# EasyEDA Pro project ProPrj_FOC_STM32F446.epro, board PCB1
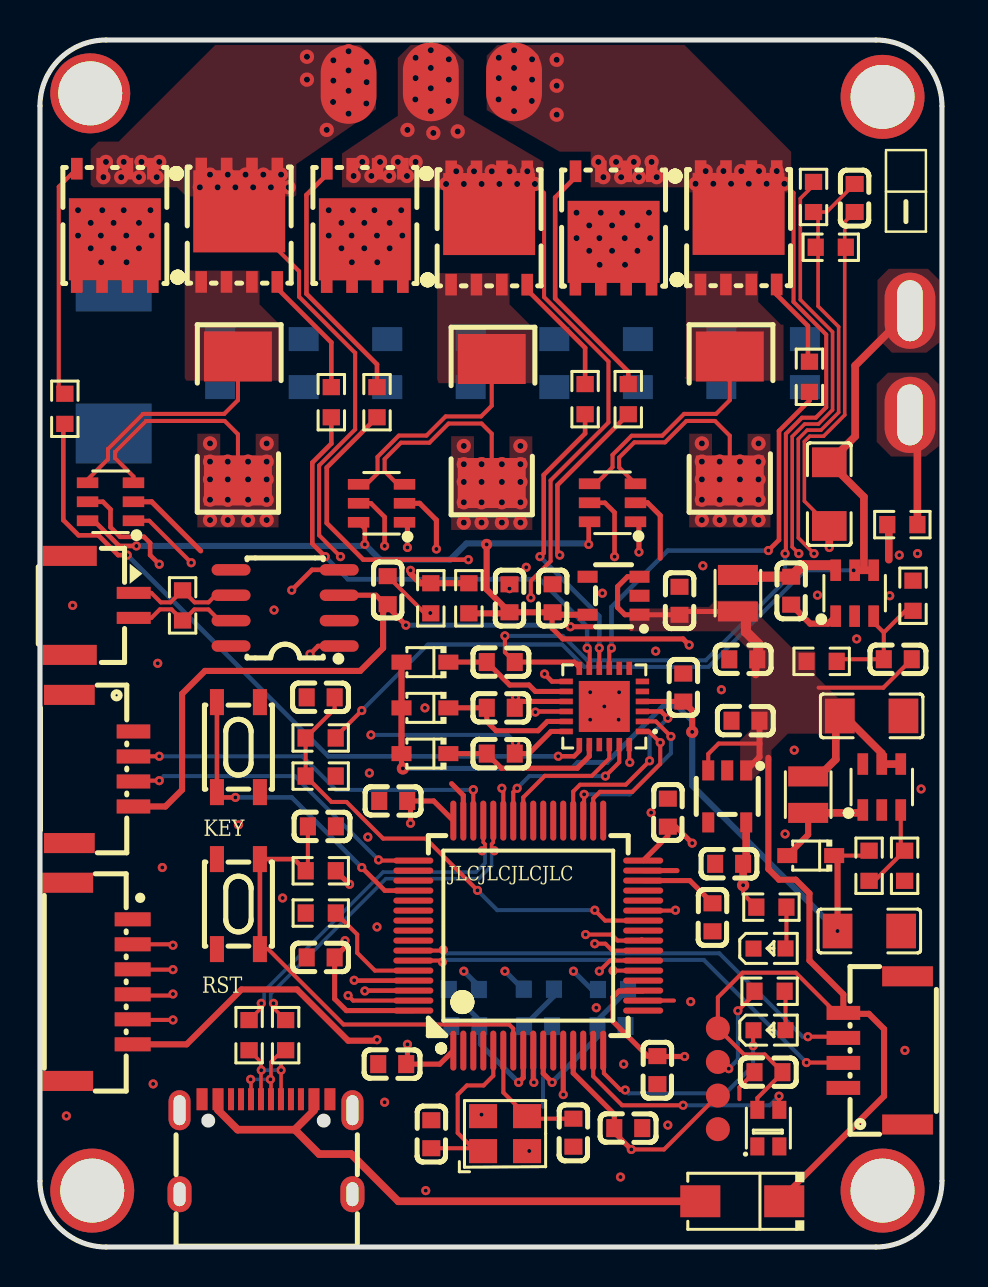
[diagram p3: board, top side]
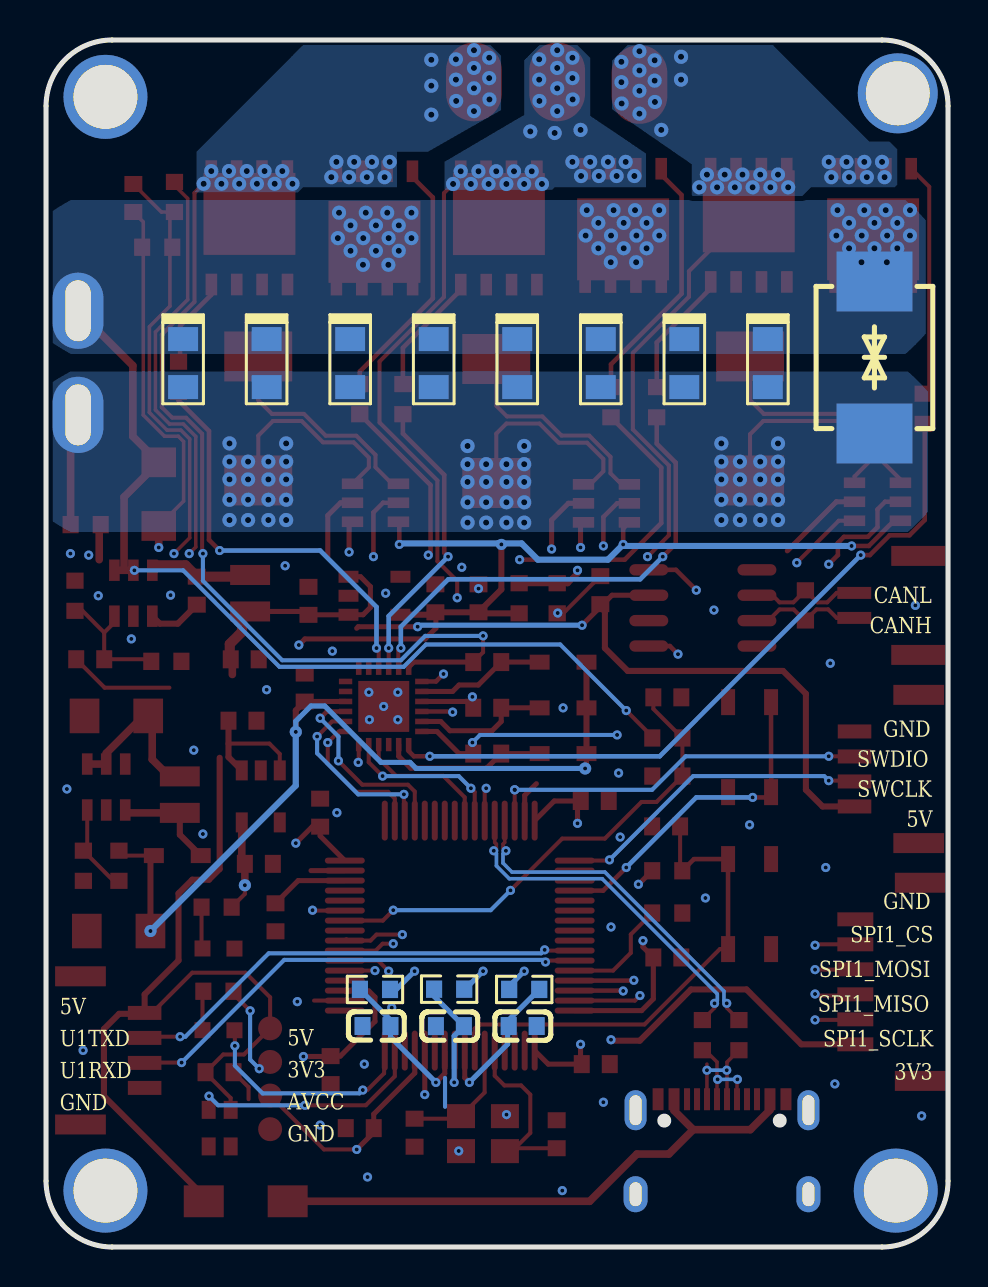
[diagram p4: board, bottom side, seen from below]

Outline 45.14 x 60.35 mm; copper layers: Top Layer, Inner1, Inner2, Bottom Layer. Coordinates in mm from the lower left corner of the outline.
Outline path: 0,57.05 0,3.3 arc(0.97,0.97) 3.3,0 41.83,0 arc(44.17,0.97) 45.14,3.3 45.14,57.05 arc(44.17,59.38) 41.83,60.35 3.3,60.35 arc(0.97,59.38) 0,57.05
Stack: Top Layer 0.035mm 外层铜厚1oz / Dielectric1 0.2104mm 7628 RC49% 8.6mil / Inner1 0.0152mm 内层铜厚 / Dielectric2 1.065mm 1.1mm H/HOZ 含铜 / Inner2 0.0152mm 内层铜厚 / Dielectric3 0.2104mm 7628 RC49% 8.6mil / Bottom Layer 0.035mm 外层铜厚1oz

## Design rules (mm)
net USB_DP: DP1
net USB_DN: DP1
template: 自定义配置
spacing copperThickness1oz (default): track to track 0.127, other pairs 0.102 to 0.152
spacing copperThickness2oz: track to track 0.203, other pairs 0.152 to 0.3
track width copperThickness1oz (default): min 0.127, default 0.254, max 2.54
track width copperThickness2oz: min 0.203, default 0.254, max 2.54
differential pair differentialPair (default): width min 0.127, default 0.254, max 2.54; gap min 0.152, default 0.152
via viaSize (default): diameter min 0.457, default 0.61, max 10; hole min 0.203, default 0.203, max 6.299
net DCBUS uses copperRegion1
net PGND uses copperRegion1, innerPlane1

## Placement (name value [footprint] x y rotation side)
C1  1UF  [C0603]  35.31 26.31 0 top
C2  1UF  [C0603]  34.49 19.16 0 top
C3  22uF  [C1206]  41.5 15.8 180 top
C4  22uF  [C1206]  41.62 26.56 0 top
C5  100nF  [C0603]  37.59 32.82 90 top
C6  1UF  [C0603]  32 32.31 270 top
C7  1UF  [C0603]  25.65 32.44 270 top
C8  100nF  [C0603]  23.5 32.44 270 top
C9  10uF  [C1206]  39.5 37.64 90 top
C10  10UF  [C0603]  35.19 29.38 0 top
C11  470PF  [C0603]  42.93 29.39 180 top
C12  22uF  [CAP-SMD_L3.2-W1.6-FD]  13.2 44.2 270 bottom
C13  22uF  [CAP-SMD_L3.2-W1.6-FD]  21.56 44.2 270 bottom
C14  22uF  [CAP-SMD_L3.2-W1.6-FD]  25.74 44.2 270 bottom
C15  22uF  [CAP-SMD_L3.2-W1.6-FD]  34.1 44.2 270 bottom
C16  22uF  [CAP-SMD_L3.2-W1.6-FD]  17.38 44.2 270 bottom
C17  22uF  [CAP-SMD_L3.2-W1.6-FD]  29.92 44.2 270 bottom
C18  22uF  [CAP-SMD_L3.2-W1.6-FD]  9.02 44.2 270 bottom
C19  1UF  [C0603]  14.05 27.48 0 top
C20  100nF  [C0603]  36.45 8.74 0 top
C21  1nF  [C0603]  21.29 11.05 0 bottom
C22  1nF  [C0603]  24.93 11.04 180 bottom
C23  1nF  [C0603]  28.6 11.05 180 bottom
C24  100nF  [C0603]  29.44 5.94 0 top
C25  100nF  [C0603]  14.11 21.03 180 top
C26  2.2UF  [C0603]  33.66 16.48 90 top
C27  100nF  [C0603]  17.68 22.3 0 top
C28  100nF  [C0603]  31.42 21.72 270 top
C29  100nF  [C0603]  30.9 8.84 90 top
C30  100nF  [C0603]  17.63 9.14 0 top
C31  100nF  [C0603]  14.05 14.48 0 top
C32  100nF  [C0603]  17.4 32.84 270 top
C33  12PF  [C0603]  26.7 5.72 90 top
C34  12PF  [C0603]  19.58 5.64 270 top
C35  1UF  [C0603]  23.06 24.67 180 top
C36  1UF  [C0603]  23.06 26.96 180 top
C37  10UF  [C0603]  32.19 27.97 270 top
C39  1UF  [C0603]  23.06 29.25 180 top
C40  2.2UF  [C0603]  40.77 52.45 90 top
C41  22uF  [CAP-SMD_L3.2-W1.6-FD]  38.28 44.2 270 bottom
CN1  L125WVS-02PW  [CONN-SMD_2P-P1.25_DELON_L125WVS-02PW]  3.09 32.08 270 top
D1  1N5819WS  [SOD-323_L1.8-W1.3-LS2.5-RD]  38.57 19.57 180 top
D2  SMCJ36CA  [SMC_L7.2-W5.8-LS8.1-BI]  3.68 44.48 90 bottom
D3  SS34  [SMA_L4.3-W2.5-LS5.0-RD]  35.14 2.29 180 top
D4  1N5819WS  [SOD-323_L1.8-W1.3-LS2.5-RD]  19.26 24.67 180 top
D5  1N5819WS  [SOD-323_L1.8-W1.3-LS2.5-RD]  19.26 26.96 180 top
D6  1N5819WS  [SOD-323_L1.8-W1.3-LS2.5-RD]  19.26 29.24 180 top
J1  GH1.25  [conn-smd_4p-p1.25_js_gh125-s04cca-00]  41.94 9.83 90 top
J2  GH1.25  [conn-smd_4p-p1.25_js_gh125-s04cca-00]  2.95 23.9 270 top
L1  10uH  [IND-SMD_L2.5-W2.0_FNR252012S]  38.44 22.62 270 top
L2  4.7uH  [IND-SMD_L2.5-W2.0_FNR252012S]  34.92 32.69 90 top
LED1  -  [LED_0603]  36.56 14.93 0 top
LED2  WS2812B-2020  [LED-SMD_4P-L2.0-W2.0-TL_WS2812B-2020]  36.45 5.94 90 top
LED3  -  [LED_0603]  36.56 10.85 0 top
NOREF  -  [Pad_e450]  15.44 58.13 180 top
NOREF#2  -  [Pad_e458]  42.16 2.82 180 top
NOREF#3  -  [Pad_e454]  42.16 57.51 180 top
NOREF#4  -  [Pad_e685]  23.72 58.26 180 top
NOREF#5  -  [Pad_e457]  2.62 2.82 180 top
NOREF#6  -  [Pad_e270]  43.54 46.81 0 top
NOREF#7  -  [Pad_e663]  19.56 58.26 180 top
NOREF#8  -  [Pad_e267]  43.54 41.61 0 top
NOREF#9  -  [Pad_e456]  2.52 57.68 180 top
Q1  KNY3406C  [PDFN-8_L4.9-W5.8-P1.27-LS6.1-BL]  3.75 51.08 180 top
Q2  KNY3406C  [PDFN-8_L4.9-W5.8-P1.27-LS6.1-BL]  16.26 51.08 180 top
Q3  KNY3406C  [PDFN-8_L4.9-W5.8-P1.27-LS6.1-BL]  28.7 50.95 180 top
Q4  KNY3406C  [PDFN-8_L4.9-W5.8-P1.27-LS6.1-BL]  9.97 51.09 0 top
Q5  KNY3406C  [PDFN-8_L4.9-W5.8-P1.27-LS6.1-BL]  22.48 50.95 0 top
Q6  KNY3406C  [PDFN-8_L4.9-W5.8-P1.27-LS6.1-BL]  34.96 50.96 0 top
R1  100kΩ  [R0603]  41.49 19.06 90 top
R2  10K  [R0603]  36.6 16.99 0 top
R3  5.1kΩ  [R0603]  43.27 19.06 90 top
R4  52.3K  [R0603]  39.12 29.28 0 top
R5  10K  [R0603]  43.69 32.56 270 top
R6  0R  [R0603]  43.15 36.12 0 top
R7  10K  [R0603]  14.05 25.45 0 top
R8  1K  [R0603]  14.05 23.55 180 top
R9  10K  [R0603]  14.05 16.7 180 top
R10  22R  [R0603]  12.29 10.59 270 top
R11  22R  [R0603]  10.47 10.59 270 top
R12  22  [R0603]  21.21 12.88 180 bottom
R13  22  [R0603]  24.97 12.89 0 bottom
R14  22  [R0603]  28.68 12.88 0 bottom
R15  10K  [R0603]  14.05 18.81 0 top
R16  120R  [R0603]  7.14 32.08 270 top
R17  10K  [R0603]  36.51 12.79 180 top
R18  1K  [R0603]  21.46 32.44 270 top
R19  1K  [R0603]  19.56 32.44 90 top
R20  10R  [R0603]  1.24 41.91 90 top
R21  10R  [R0603]  16.87 42.24 90 top
R22  10R  [R0603]  29.44 42.39 90 top
R23  TCTR0603F10K0F3930T  [R0603]  38.71 52.5 90 top
R24  10R  [R0603]  14.58 42.24 90 top
R25  10R  [R0603]  27.28 42.39 90 top
R26  3.3K  [R0603]  39.57 49.99 180 top
R27  10R  [R0603]  38.51 43.51 90 top
R28  5mΩ  [RES-SMD_L6.4-W3.2-1]  9.91 41.43 90 top
R29  5mΩ  [RES-SMD_L6.4-W3.2-1]  22.61 41.3 90 top
R30  5mΩ  [RES-SMD_L6.4-W3.2-1]  34.52 41.43 90 top
SW1  TS-1089S-02526  [SW-SMD_4P-L4.2-W3.3-P2.15-LS5.1]  9.93 17.15 270 top
SW2  TS-1089S-02526  [SW-SMD_4P-L4.2-W3.3-P2.15-LS5.1]  9.93 24.99 90 top
TP1  Testpoint 1.6mm  [TESTPOINT 1.6MM]  33.92 10.93 0 top
TP2  Testpoint 1.6mm  [TESTPOINT 1.6MM]  33.92 9.25 0 top
TP3  Testpoint 1.6mm  [TESTPOINT 1.6MM]  33.92 7.57 0 top
TP4  Testpoint 1.6mm  [TESTPOINT 1.6MM]  33.92 5.89 0 top
U1  LP5907MFX-3.3/NOPB  [SOT-23-5_L3.0-W1.7-P0.95-LS2.8-BR]  34.39 22.53 90 top
U2  MT3608  [SOT-23-6_L2.9-W1.6-P0.95-LS2.8-BL]  42.13 23 0 top
U3  LP5907MFX-3.3/NOPB  [SOT-23-5_L3.0-W1.7-P0.95-LS2.8-BR]  28.7 32.56 0 top
U4  RY8411  [SOT-23-6_L2.9-W1.6-P0.95-LS2.8-TL]  40.77 32.69 90 top
U5  STM32F446RET6  [LQFP-64_L10.0-W10.0-P0.50-LS12.0-BL]  24.44 15.57 0 top
U6  TJA1050T/CM,118  [SOIC-8_L5.0-W4.0-P1.27-LS6.0-BL]  12.27 31.95 90 top
U7  INA181A2IDBVR  [SOT-23-6_L2.9-W1.6-P0.95-LS2.8-BL]  3.53 37.26 90 top
U8  FD6288Q  [QFN-24_L4.0-W4.0-P0.50-BL-EP2.6]  28.24 27.03 90 top
U9  INA181A2IDBVR  [SOT-23-6_L2.9-W1.6-P0.95-LS2.8-BL]  17.09 37.19 90 top
U10  INA181A2IDBVR  [SOT-23-6_L2.9-W1.6-P0.95-LS2.8-BL]  28.65 37.21 90 top
USB1  TYPE-C 16PIN 2MD(073)  [USB-C-SMD_TYPE-C-6PIN-2MD-073]  11.31 5.01 0 top
X1  GH125-S06DCA-00  [conn-smd_6p-p1.25_jushuo_gh125-s06dca-00]  2.89 13.26 270 top
X2  8MHz  [OSC-SMD_4P-L3.2-W2.5-BL]  23.27 5.67 0 top

## Footprints (pads in the part's own frame, mm; a bottom-side part is the same pattern mirrored in y, then rotated)
C0603
  rect 0.8x0.9 smd: 1(-0.7,0) 2(0.7,0)
C1206
  rect 1.485x1.728 smd: 1(-1.593,0) 2(1.593,0)
CAP-SMD_L3.2-W1.6-FD
  rect 1.2x1.5 smd: 1(-1.2,0) 2(1.2,0)
CONN-SMD_2P-P1.25_DELON_L125WVS-02PW
  rect 0.6x1.7 smd: 1(-0.625,1.6) 2(0.625,1.6)
  rect 1x2.7 smd: 3(2.475,-1.6) 4(-2.475,-1.6)
conn-smd_4p-p1.25_js_gh125-s04cca-00
  rect 0.7x1.68 smd: 1(-1.875,1.732) 2(-0.625,1.732) 3(0.625,1.732) 4(1.875,1.732)
  rect 1x2.54 smd: 5(3.705,-1.478) 6(-3.705,-1.478)
conn-smd_6p-p1.25_jushuo_gh125-s06dca-00
  rect 0.7x1.8 smd: 1(-3.125,1.75) 2(-1.875,1.75) 3(-0.625,1.75) 4(0.625,1.75) 5(1.875,1.75) 6(3.125,1.75)
  rect 1x2.54 smd: 7(4.955,-1.497) 8(-4.955,-1.497)
IND-SMD_L2.5-W2.0_FNR252012S
  rect 1.001x1.999 smd: 1(0.912,0) 2(-0.912,0)
LED-SMD_4P-L2.0-W2.0-TL_WS2812B-2020
  rect 0.9x0.7 smd: 1(-0.915,0.55) 2(-0.915,-0.55) 3(0.915,-0.55) 4(0.915,0.55)
LED_0603
  rect 0.8x0.8 smd: 1(-0.851,-0.01) 2(0.75,-0.005)
LQFP-64_L10.0-W10.0-P0.50-LS12.0-BL
  oval 0.3x2 smd: 1(-3.75,-5.75) 2(-3.25,-5.75) 3(-2.75,-5.75) 4(-2.25,-5.75) 5(-1.75,-5.75) 6(-1.25,-5.75) 7(-0.75,-5.75) 8(-0.25,-5.75) 9(0.25,-5.75) 10(0.75,-5.75) 11(1.25,-5.75) 12(1.75,-5.75) 13(2.25,-5.75) 14(2.75,-5.75) 15(3.25,-5.75) 16(3.75,-5.75) 33(3.75,5.75) 34(3.25,5.75) 35(2.75,5.75) 36(2.25,5.75) 37(1.75,5.75) 38(1.25,5.75) 39(0.75,5.75) 40(0.25,5.75) 41(-0.25,5.75) 42(-0.75,5.75) 43(-1.25,5.75) 44(-1.75,5.75) 45(-2.25,5.75) 46(-2.75,5.75) 47(-3.25,5.75) 48(-3.75,5.75)
  oval 2x0.3 smd: 17(5.75,-3.75) 18(5.75,-3.25) 19(5.75,-2.75) 20(5.75,-2.25) 21(5.75,-1.75) 22(5.75,-1.25) 23(5.75,-0.75) 24(5.75,-0.25) 25(5.75,0.25) 26(5.75,0.75) 27(5.75,1.25) 28(5.75,1.75) 29(5.75,2.25) 30(5.75,2.75) 31(5.75,3.25) 32(5.75,3.75) 49(-5.75,3.75) 50(-5.75,3.25) 51(-5.75,2.75) 52(-5.75,2.25) 53(-5.75,1.75) 54(-5.75,1.25) 55(-5.75,0.75) 56(-5.75,0.25) 57(-5.75,-0.25) 58(-5.75,-0.75) 59(-5.75,-1.25) 60(-5.75,-1.75) 61(-5.75,-2.25) 62(-5.75,-2.75) 63(-5.75,-3.25) 64(-5.75,-3.75)
OSC-SMD_4P-L3.2-W2.5-BL
  rect 1.4x1.2 smd: 1(-1.1,-0.875) 2(1.1,-0.875) 3(1.1,0.875) 4(-1.1,0.875)
Pad_e267
  oval 2.54x3.81 hole 1.27x3.048: 66(0,0)
Pad_e270
  oval 2.54x3.81 hole 1.27x3.048: 66(0,0)
Pad_e450
  oval 2.794x3.937 smd: 1(0,0)
Pad_e454
  round 4.2 hole 3.2: 1(0,0)
Pad_e456
  round 4 hole 3.2: 1(0,0)
Pad_e457
  round 4.2 hole 3.2: 1(0,0)
Pad_e458
  round 4.2 hole 3.2: 1(0,0)
Pad_e663
  oval 2.794x3.937 smd: 1(0,0)
Pad_e685
  oval 2.794x3.937 smd: 1(0,0)
PDFN-8_L4.9-W5.8-P1.27-LS6.1-BL
  rect 0.58x1.079 smd: 1(-1.907,-2.834) 2(-0.637,-2.834) 3(0.632,-2.834) 4(1.903,-2.834)
  rect 0.58x1.08 smd: 5(1.907,2.834) 6(0.637,2.834) 7(-0.632,2.834) 8(-1.903,2.834)
  rect 4.6x4.1 smd: 9(-0.003,0.695)
QFN-24_L4.0-W4.0-P0.50-BL-EP2.6
  rect 0.28x0.665 smd: 1(-1.25,-1.907) 2(-0.75,-1.907) 3(-0.25,-1.907) 4(0.25,-1.907) 5(0.75,-1.907) 6(1.25,-1.907) 13(1.25,1.907) 14(0.75,1.907) 15(0.25,1.907) 16(-0.25,1.907) 17(-0.75,1.907) 18(-1.25,1.907)
  rect 0.665x0.28 smd: 7(1.907,-1.25) 8(1.907,-0.75) 9(1.907,-0.25) 10(1.907,0.25) 11(1.907,0.75) 12(1.907,1.25) 19(-1.907,1.25) 20(-1.907,0.75) 21(-1.907,0.25) 22(-1.907,-0.25) 23(-1.907,-0.75) 24(-1.907,-1.25)
  rect 2.55x2.55 smd: 25(0,0)
R0603
  rect 0.806x0.864 smd: 1(-0.753,0) 2(0.753,0)
RES-SMD_L6.4-W3.2-1
  rect 2.5x3.4 smd: 1(-3.1,0) 2(3.1,0)
SMA_L4.3-W2.5-LS5.0-RD
  rect 2x1.593 smd: 1(-2.1,0) 2(2.1,0)
SMC_L7.2-W5.8-LS8.1-BI
  rect 3x3.8 smd: 1(-3.8,0) 2(3.8,0)
SOD-323_L1.8-W1.3-LS2.5-RD
  rect 1x0.75 smd: 1(-1.173,0) 2(1.173,0)
SOIC-8_L5.0-W4.0-P1.27-LS6.0-BL
  oval 0.569x1.95 smd: 1(-1.905,-2.705) 2(-0.635,-2.705) 3(0.635,-2.705) 4(1.905,-2.705) 5(1.905,2.705) 6(0.635,2.705) 7(-0.635,2.705) 8(-1.905,2.705)
SOT-23-5_L3.0-W1.7-P0.95-LS2.8-BR
  rect 1x0.6 smd: 1(1.3,-0.95) 2(1.3,0) 3(1.3,0.95) 4(-1.3,0.95) 5(-1.3,-0.95)
SOT-23-6_L2.9-W1.6-P0.95-LS2.8-BL
  rect 0.532x1.072 smd: 1(-0.95,-1.149) 2(0,-1.149) 3(0.95,-1.149) 4(0.95,1.149) 5(0,1.149) 6(-0.95,1.149)
SOT-23-6_L2.9-W1.6-P0.95-LS2.8-TL
  rect 1.072x0.532 smd: 1(-1.149,0.95) 2(-1.149,0) 3(-1.149,-0.95) 4(1.149,-0.95) 5(1.149,0) 6(1.149,0.95)
SW-SMD_4P-L4.2-W3.3-P2.15-LS5.1
  rect 1.3x0.7 smd: 1(-2.25,1.075) 2(2.25,1.075) 3(-2.25,-1.075) 4(2.25,-1.075)
TESTPOINT 1.6MM
  round 1.2 smd: 1(0,0)
USB-C-SMD_TYPE-C-6PIN-2MD-073
  rect 0.55x1.1 smd: 1(-3.2,2.375) 2(-2.4,2.375) 11(2.4,2.375) 12(3.2,2.375)
  rect 0.3x1.1 smd: 3(-1.75,2.375) 4(-1.25,2.375) 5(-0.75,2.375) 6(-0.25,2.375) 7(0.25,2.375) 8(0.75,2.375) 9(1.25,2.375) 10(1.75,2.375)
  oval 1.1x2 hole 0.6x1.5: 13(-4.325,1.825) 14(4.325,1.825)
  oval 1.2x1.8 hole 0.6x1.2: 13(-4.325,-2.375) 14(4.325,-2.375)

## Nets
As in the schematic, except:
PGND: C12.2 C13.2 C14.2 C15.2 C16.2 C17.2 C18.2 C41.2 D2.1 NOREF#8.66 R6.2 R28.1 R29.1 R30.1 U7.3 U9.3 U10.3
DCBUS: C9.2 C12.1 C13.1 C14.1 C15.1 C16.1 C17.1 C18.1 C41.1 D2.2 NOREF#6.66 Q1.5 Q1.6 Q1.7 Q1.8 Q1.9 Q2.5 Q2.6 Q2.7 Q2.8 Q2.9 Q3.5 Q3.6 Q3.7 Q3.8 Q3.9 R7.2 U4.4 U4.5
SH_A: C35.1 NOREF.1 Q1.1 Q1.2 Q1.3 Q4.5 Q4.6 Q4.7 Q4.8 Q4.9 U8.18
SH_B: C36.1 NOREF#7.1 Q2.1 Q2.2 Q2.3 Q5.5 Q5.6 Q5.7 Q5.8 Q5.9 U8.15
SH_C: C39.1 NOREF#4.1 Q3.1 Q3.2 Q3.3 Q6.5 Q6.6 Q6.7 Q6.8 Q6.9 U8.12

Pads without a net: LED2 1; NOREF#2 1; NOREF#3 1; NOREF#5 1; NOREF#9 1; U1 4; U2 6; U3 4; U5 2 3 4 11 14 17 20 25 28 29 33 37 38 39 40 50 51 53 54 55 56 57; U6 5; U8 5 7 8 21; USB1 3 4 9 10

## Via types
v1: diameter 0.711, hole 0.305, Top Layer to Bottom Layer, 198 vias
v2: diameter 0.457, hole 0.203, Top Layer to Bottom Layer, 146 vias
v3: diameter 0.559, hole 0.203, Top Layer to Bottom Layer, 1 via
v4: diameter 0.61, hole 0.203, Top Layer to Bottom Layer, 4 vias

## Routing (per net, layer and track width the routed paths; a pad name or vN(x,y) marks a point on that pad's centre or on a via; arc(x,y) is an arc through that point)
AVCC: length 86.2
  Top Layer w0.203: v2(29.59,4.88) 31.23,4.88 TP3.1 ; 28.74,5.73 C24.1
  Top Layer w0.229: v2(27.46,35.13) 27.46,36.22 U10.6 ; 15.95,36.24 16.26,35.93 v2(16.26,35.13) ; v2(4.83,35.05) 3.96,35.05 2.71,36.31 U7.6
  Top Layer w0.254: v2(32.49,30.1) 32.18,30.4 26.16,30.4 25.63,30.94 25.63,31.71 C7.2 ; v2(29.59,4.88) 28.74,5.73 ; 26.68,9.82 26.68,8.7 28.74,6.64 C24.1
  Top Layer w0.305: U3.5 25.78,31.61 C7.2 C8.2 ; v3(22.35,35.13) 22.35,32.88 C8.2 ; C8.2 23.44,31.68 R18.2
  Inner2 w0.254: v2(32.49,30.1) 32.72,30.1 33.25,29.57 33.25,12.04 34.01,11.28 34.01,9.65 29.59,5.23 v2(29.59,4.88)
  Bottom Layer w0.305: v3(22.35,35.13) 22.46,35.13 22.52,35.18 ; 22.52,35.18 21.34,35.18 20.52,34.37 17.02,34.37 v2(16.26,35.13) 16.18,35.05 v2(4.83,35.05) ; 22.52,35.18 27.41,35.18 v2(27.46,35.13)
GND: length 48.9
  Top Layer w0.178: C40.1 40.27,51.26 40.27,41.6 39.21,40.54 38.52,40.54 38.25,40.27 38.25,37.3 C9.1
  Top Layer w0.203: v2(19.53,31.7) 19.54,31.7 R19.1 19.26,31.68 C32.1 ; 30.18,12.32 31.72,12.32 ; 35,7.39 35,7.99 C20.1 ; U5.63 15.67,12.32 v2(15.42,12.57)
  Top Layer w0.254: 20.6,23.17 21.19,22.58 U5.47 ; 8.04,34.81 5.59,37.26 U7.2 ; U10.2 30.4,37.21 31.04,36.58 31.04,34.44 ; 30.18,18.82 31.88,18.82 ; v2(19.84,34.9) 19.84,36.35 19,37.19 18.24,37.19 ; U5.12 v2(26.19,7.62)
  Top Layer w0.381: 42.48,34.37 42.48,36.04 R6.1 ; v2(39.5,34.98) C9.1
  Bottom Layer w0.203: 25.17,8.46 25.17,7.01
  vias: v2(1.32,6.55) v2(1.64,32.08) v2(5.66,8.15) v2(5.89,29.18) v2(6.12,18.97) v2(9.93,21.11) v2(11.71,31.85) v2(12.14,17.45) v2(16.48,23.7) v2(16.41,20.5) v2(16.87,16) v2(17.25,7.24) v2(19.26,26.96) v2(19.3,2.82) v2(22.1,6.62) v2(23.5,32.92) v2(24.33,33.99) v2(24.49,4.8) v2(27.53,27.74) v2(27.53,26.37) v2(27.84,11.96) v2(28.14,32.69) v2(28.24,27.03) v2(28.98,27.74) v2(28.96,26.37) v2(29.05,3.5) v2(29.21,9.14) v2(30.81,29.79) v2(31.42,6.1) v2(32.56,12.27) v2(33.17,34.06) v2(34.1,27.86) v2(37.29,20.65) v2(37.74,24.84) v2(38.91,32.59) v2(40.87,30.4) v2(42.52,32.56) v2(43,34.6) v2(43.28,9.83) v2(43.92,34.67) v2(44.09,22.9)
PGND: length 38.1
  Top Layer w0.203: R28.1 9.91,40.64 9.25,41.3 5.31,41.3 3.76,39.75 3.76,39.45 4.68,38.53 U7.3 ; R29.1 22.61,40.67 22.1,41.17 20.45,41.17 19.49,40.22 18.07,40.22 17.25,39.4 17.25,38.79 17.9,38.14 18.24,38.14 ; U10.3 28.98,38.98 28.98,39.47 29.74,40.23 31.28,40.23 32.34,41.3 33.78,41.3 34.52,40.56 R30.1
  Top Layer w0.381: NOREF#8.66 43.91,41.23 R6.2
  vias: v1(8.51,40.18) v1(8.51,39.27) v1(8.51,38.38) v1(8.51,37.36) v1(8.51,36.35) v1(9.4,39.27) v1(9.4,38.38) v1(9.4,37.36) v1(9.4,36.35) v1(10.41,39.27) v1(10.41,38.38) v1(10.41,37.36) v1(10.41,36.35) v1(11.34,40.18) v1(11.34,39.27) v1(11.34,38.38) v1(11.34,37.36) v1(11.34,36.35) v1(21.21,40.05) v1(21.21,39.14) v1(21.21,38.25) v1(21.21,37.24) v1(21.21,36.22) v1(22.1,39.14) v1(22.1,38.25) v1(22.1,37.24) v1(22.1,36.22) v1(23.11,39.14) v1(23.11,38.25) v1(23.11,37.24) v1(23.11,36.22) v1(24.04,40.05) v1(24.04,39.14) v1(24.04,38.25) v1(24.04,37.24) v1(24.04,36.22) v1(33.12,40.18) v1(33.12,39.27) v1(33.12,38.38) v1(33.12,37.36) v1(33.12,36.35) v1(34.01,39.27) v1(34.01,38.38) v1(34.01,37.36) v1(34.01,36.35) v1(35.03,39.27) v1(35.03,38.38) v1(35.03,37.36) v1(35.03,36.35) v1(35.96,40.18) v1(35.96,39.27) v1(35.96,38.38) v1(35.96,37.36) v1(35.96,36.35)
VBUS: length 24.4
  Top Layer w0.203: v2(27.76,16.84) 28.28,16.32 30.18,16.32 ; v2(21.89,17.83) 19.3,20.42 17.17,20.42 15.34,22.25 14.59,22.25 13.29,23.55 13.29,25.45 14.75,26.9 C19.2
  Bottom Layer w0.203: v2(21.89,17.83) 22.89,16.84 v2(27.76,16.84)
VCC_3.3V: length 89.9
  Top Layer w0.178: v2(37.97,34.67) 37.64,35 37.64,40.53 38.26,41.15 38.96,41.15 39.66,41.86 39.66,45.75 38.05,47.37 38.05,52.43 38.73,53.1
  Top Layer w0.203: R2.1 35.19,17.65 v4(35.19,18.09) ; v2(34.47,8.92) 34.13,9.25 TP2.1 ; 35.76,12.79 35.76,12.64 v2(34.92,11.81)
  Top Layer w0.254: v2(32.26,9.53) 30.92,9.53 C29.2 30.41,9.54 28.68,11.28 28.68,12.5 28.98,12.8 30.17,12.8 30.18,12.82 ; v2(15.49,18.14) 15.48,18.14 R15.2 ; v2(18.39,10.13) 18.39,9.21 C30.2 20.01,9.14 20.68,9.82 ; v2(18.54,21.18) 18.54,22.14 C27.2 19.7,22.3 20.68,21.32 ; v2(32.64,20.19) 31.82,21.02 C28.2 31.42,20.56 30.18,19.32 ; 38.73,53.11 38.73,53.1 38.71,53.12 R23.2 ; U5.64 15.33,11.82 14.75,12.41 C31.2 15.27,15 v2(15.27,15.32)
  Top Layer w0.305: v2(16.87,10.36) 16.82,10.32 15.42,10.32 12.86,12.88 10.08,12.88 7.34,10.13 4.64,10.13
  Top Layer w0.381: v4(35.19,18.09) C2.2 35.34,19.31 U1.5
  Inner2 w0.203: v2(30.58,21.72) 31.09,22.23 31.09,24.41 30.58,24.92 30.58,28.19 31.7,29.31 31.7,30.85 34.64,33.78 37.41,33.78 37.97,34.34 v2(37.97,34.67)
  Bottom Layer w0.203: v2(34.47,8.92) 34.92,9.37 v2(34.92,11.81)
  Bottom Layer w0.254: v2(32.26,9.53) 32.33,9.53
VCC_5V: length 111.9
  Top Layer w0.203: C11.1 42.2,27.97 38.96,27.97 ; U1.3 33.44,24.65 33.96,25.17 36.01,25.17 ; LED2.4 35.9,7.45 37.15,8.71 C20.2 36.27,9.63 35.23,9.63 TP1.1 33.92,12.49 35.15,13.72 37.82,13.72 39.83,11.71 J1.4
  Top Layer w0.254: U3.3 29.4,33.51 28.91,33.02 28.91,31.98 29.27,31.61 U3.1 30.01,31.61 C6.2 32.17,31.78 L2.2 ; U6.3 16.82,32.59 17.4,32 v2(18.31,31.09) ; 29.59,30.94 29.52,31.01 v2(26.54,31.01)
  Top Layer w0.305: D3.1 37.24,2.55 42.24,7.54 42.24,10.9 41.48,11.66 40.25,11.66 J1.4 40.2,12.63 38.51,14.33 38.51,17.68 37.82,18.36 36.98,18.36 36.45,18.9 36.45,24.46 ; C32.2 17.4,32 17.17,31.78 17.17,29.95 16.03,28.8 8.26,28.8 7.11,27.66 7.11,22.86 6.28,22.03 4.68,22.03 ; U1.1 36.01,24.49 C1.2 ; 39.78,26.31 39.82,26.35
  Top Layer w0.381: 35.81,28.63 35.81,29.3 C10.2 ; 38.44,23.53 38.97,23.53 39.82,24.38 39.82,26.35 ; C4.1 40.26,26.56 42.13,24.69 U2.5 U2.4
  Top Layer w0.508: L2.2 35.33,31.78 35.33,30.76 35.94,30.15 35.94,29.43 C10.2
  Bottom Layer w0.254: v2(26.54,31.01) 26.47,31.09 v2(18.31,31.09)
CAN1_RX: length 26.6
  Top Layer w0.229: U6.4 13.61,33.86 v2(12.6,32.84) ; v2(15.72,13.34) 15.74,13.32 U5.61
  Inner2 w0.229: v2(12.6,32.84) 12.6,16.46 v2(15.72,13.34)
CAN1_TX: length 22.4
  Top Layer w0.229: U6.1 13.92,30.05 v2(13.51,29.64) ; U5.62 16.27,12.82 v2(16.26,12.8)
  Inner2 w0.229: v2(16.26,12.8) 16.26,13.49 13.13,16.61 13.13,29.26 v2(13.51,29.64)
CAN_H: length 5.7
  Top Layer w0.203: U6.7 8.99,31.32 8.43,31.88 7.72,31.88 7.17,31.33 R16.2 6.58,31.88 6,31.88 5.57,31.46 4.75,31.46
CAN_L: length 5.7
  Top Layer w0.203: U6.6 8.79,32.59 8.43,32.23 7.74,32.23 7.14,32.83 6.54,32.23 6.05,32.23 5.57,32.71 4.75,32.71
CUR_A: length 34.6
  Top Layer w0.203: U7.1 5.47,36.31 v2(7.57,34.21)
  Inner2 w0.254: v2(21.21,13.79) 21.21,16.38 15.49,22.1 15.49,32.39 13.67,34.21 v2(7.57,34.21)
  Bottom Layer w0.254: v2(21.21,13.79) 21.96,13.04 R12.1
CUR_B: length 26.5
  Top Layer w0.254: v2(18.39,34.98) 18.39,36.09 18.24,36.24
  Inner2 w0.254: v2(23.27,13.79) 23.27,15.16 17.63,20.8 17.63,34.21 v2(18.39,34.98)
  Bottom Layer w0.254: R13.1 24.17,12.89 v2(23.27,13.79)
CUR_C: length 25.5
  Top Layer w0.254: v2(29.97,34.75) 29.97,36.09 U10.1
  Inner2 w0.254: v2(26.7,13.79) 26.7,16.54 29.97,19.81 v2(29.97,34.75)
  Bottom Layer w0.254: v2(26.7,13.79) 27.61,12.88 R14.1
DCBUS: length 47.6
  Top Layer w0.203: v2(16.1,26.82) 14.8,25.52 R7.2 ; v2(40.72,33.83) 40.76,33.83 U4.5
  Top Layer w0.381: NOREF#6.66 40.79,44.07 40.79,40.53 C9.2 41.23,37.5 41.23,33.84 ; 41.23,33.84 U4.5 ; 41.23,33.84 U4.4
  Inner2 w1.016: 43.13,47.47 43.13,47.22 NOREF#6.66
  Bottom Layer w0.203: v2(40.72,33.83) 38.28,33.83 33.45,29.01 27.24,29.01 26.13,30.12 19.41,30.12 v2(16.1,26.82)
  vias: v1(1.91,51.84) v1(1.91,50.57) v1(2.54,51.21) v1(2.54,49.94) v1(3.05,50.57) v1(3.06,49.24) v1(3.12,51.84) v1(3.68,51.21) v1(3.68,49.94) v1(4.19,51.84) v1(4.32,50.57) v1(4.33,49.24) v1(4.95,51.21) v1(4.95,49.94) v1(5.53,51.84) v1(5.59,50.57) v1(14.45,51.84) v1(14.45,50.57) v1(15.09,51.21) v1(15.09,49.94) v1(15.59,50.57) v1(15.61,49.24) v1(15.66,51.84) v1(16.23,51.21) v1(16.23,49.94) v1(16.74,51.84) v1(16.86,50.57) v1(16.88,49.24) v1(17.5,51.21) v1(17.5,49.94) v1(18.08,51.84) v1(18.13,50.57) v1(26.85,51.71) v1(26.85,50.44) v1(27.49,51.08) v1(27.49,49.81) v1(27.99,50.44) v1(28.01,49.11) v1(28.06,51.71) v1(28.63,51.08) v1(28.63,49.81) v1(29.14,51.71) v1(29.26,50.44) v1(29.28,49.11) v1(29.9,51.08) v1(29.9,49.81) v1(30.48,51.71) v1(30.53,50.44)
GH_A: length 36
  Top Layer w0.229: v2(25.93,24.54) 26.73,24.54 26.99,24.8 U8.19 ; R20.1 1.17,41.08 1.17,36.35 1.93,35.59 2.92,35.59 3.91,34.6 v2(4.37,34.6)
  Bottom Layer w0.229: v2(4.37,34.6) 14.43,24.54 v2(25.93,24.54)
GH_B: length 26.2
  Top Layer w0.229: v2(21.44,34.37) 16.18,34.37 14.35,36.2 14.35,38.97 R21.1 ; U8.16 24.82,26.78 v2(24.79,26.75)
  Inner2 w0.229: v2(24.79,26.75) 22.28,26.75 21.44,27.58 v2(21.44,34.37)
GH_C: length 16.1
  Top Layer w0.229: v2(25.25,28.65) 25.62,28.28 U8.13 ; 29.44,41.64 25.9,38.1 25.9,34.71 v2(26.01,34.6)
  Inner2 w0.229: v2(25.25,28.65) 25.25,33.83 v2(26.01,34.6)
GL_A: length 24.3
  Top Layer w0.203: v2(27.38,29.95) 27.51,29.82 27.51,28.95 U8.11
  Top Layer w0.229: R24.1 14.58,40.17 13.63,39.22 13.63,35.17 v2(14.28,34.52)
  Bottom Layer w0.229: v2(14.28,34.52) 15.41,33.39 25.01,33.39 27.38,31.01 v2(27.38,29.95)
GL_B: length 14.9
  Top Layer w0.203: U8.10 27.99,29.95
  Top Layer w0.229: 27.28,41.64 27.28,40.68 25.21,38.61 25.21,34.71 v2(25.02,34.52)
  Bottom Layer w0.229: v2(27.99,29.95) 27.99,31.55 v2(25.02,34.52)
GL_C: length 20.9
  Top Layer w0.203: U8.9 28.49,29.84 v2(28.6,29.95)
  Top Layer w0.229: v2(36.45,34.82) 36.98,35.36 36.98,40.8 38.51,42.33 R27.1
  Bottom Layer w0.229: v2(28.6,29.95) 28.6,32 31.42,34.82 v2(36.45,34.82)
KEY: length 16.4
  Top Layer w0.229: v2(9.78,22.48) 9.12,22.48 SW2.1 SW2.2 ; v2(16.1,18.97) 17.26,17.82 U5.52
  Bottom Layer w0.229: v2(9.78,22.48) 12.6,22.48 v2(16.1,18.97)
LED: length 11.4
  Top Layer w0.203: v2(35.69,10.06) 35.69,10.82 LED3.1 ; v2(29.29,7.85) 29.06,7.85 28.22,8.69 28.22,9.79 U5.16
  Bottom Layer w0.203: v2(35.69,10.06) 35.69,9.07 34.3,7.68 29.45,7.68 v2(29.29,7.85)
NRST: length 24.7
  Top Layer w0.203: SW1.2 11.42,14.9 15.19,11.13 23.48,11.13 23.68,10.92 23.68,9.82 ; 13.41,21.03 13.41,18.92 R15.1
  Top Layer w0.229: R15.1 12.71,19.4 SW1.1 SW1.2
OSC_IN: length 9.1
  Top Layer w0.203: 21.67,4.94 22.03,4.94 X2.1 ; 21.67,4.94 20.9,5.7 20.9,7.62 21.36,8.08 22.2,8.08 22.68,8.56 22.68,9.82 ; 21.67,4.94 C34.2
OSC_OUT: length 6.1
  Top Layer w0.203: U5.6 23.19,9.82 23.19,7.72 X2.3 24.5,6.42 C33.2
REF: length 42.5
  Top Layer w0.229: U9.5 16.56,37.19 17.25,36.5 v2(17.25,35.05) ; U7.5 3.15,37.26 3.53,36.88 3.53,35.99 4.01,35.51 5.21,35.51 5.51,35.2 5.51,34.6 v2(5.97,34.14) ; U10.5 28.27,37.21 28.75,36.73 v2(28.75,34.52)
  Top Layer w0.305: v2(18.54,33.83) 18.54,33.68 19.03,33.19 R19.2 R18.1
  Inner2 w0.305: v2(5.97,34.14) 6.96,35.13 15.27,35.13 15.8,34.6 16.71,34.6 17.58,35.46 18.98,35.46 ; 18.98,35.46 21.18,35.46 22.12,34.52 24.03,34.52 24.94,35.43 26.24,35.43 27.15,34.52 v2(28.75,34.52) ; 18.98,35.46 19,35.44 19,34.29 v2(18.54,33.83)
RGB: length 12.1
  Top Layer w0.203: 27.68,9.82 27.68,8.54 29.13,7.09 v2(32.18,7.09) ; LED2.3 36.98,6.88 v2(36.98,7.54)
  Bottom Layer w0.203: v2(36.98,7.54) 36.53,7.09 v2(32.18,7.09)
SH_A: length 41.4
  Top Layer w0.203: v2(15.04,34.52) 13.97,35.59 13.97,39.08 15.77,40.88 15.77,44.7 12.97,47.51 12.97,48.79 9.97,51.78
  Top Layer w0.254: v2(23.8,25.22) 23.8,24.71 C35.1 24.47,24.67 25.57,25.78 U8.18
  Inner2 w0.203: v2(15.04,34.52) 16.56,32.99 v2(16.56,25.6)
  Bottom Layer w0.203: v2(23.8,25.22) 23.42,25.6 v2(16.56,25.6)
  vias: v1(3.18,53.49) v1(3.3,54.25) v1(4.06,53.49) v1(4.19,54.25) v1(4.95,53.49) v1(5.08,54.25) v1(5.84,53.49) v1(5.97,54.25) v1(8,52.98) v1(8.51,53.62) v1(8.89,52.98) v1(9.4,53.62) v1(9.78,52.98) v1(10.29,53.62) v1(10.67,52.98) v1(11.18,53.62) v1(11.56,52.98) v1(12.07,53.62) v1(12.45,52.98) v1(13.36,59.51) v1(13.36,58.37) v1(14.35,55.85) v1(14.68,59.33) v1(14.68,58.32) v1(14.67,57.25) v1(15.44,59.79) v1(15.44,58.83) v1(15.44,57.81) v1(15.44,56.67) v1(16.35,59.26) v1(16.35,58.24) v1(16.33,57.18)
SH_B: length 32.3
  Top Layer w0.203: v2(23.8,27.51) 23.8,27 ; v2(24.56,32.46) 24.56,33.3 25.55,34.29 25.55,38.33 28.45,41.22 28.45,44.27 25.22,47.5 25.22,52.7 v1(24.77,53.15)
  Top Layer w0.254: C36.1 23.8,27 24.07,27.28 U8.15
  Inner2 w0.203: v2(23.8,27.51) 23.8,31.7 v2(24.56,32.46)
  vias: v1(15.7,53.55) v1(16.13,54.25) v1(16.59,53.55) v1(17.02,54.25) v1(17.47,53.55) v1(17.91,54.25) v1(18.39,55.85) v1(18.36,53.55) v1(18.8,59.46) v1(18.8,58.45) v1(18.78,57.38) v1(18.8,54.25) v1(19.56,59.84) v1(19.56,58.95) v1(19.56,57.94) v1(19.56,56.79) v1(19.69,55.7) v1(20.32,53.15) v1(20.46,59.39) v1(20.46,58.37) v1(20.45,57.3) v1(20.9,55.78) v1(20.83,53.79) v1(21.21,53.15) v1(21.72,53.79) v1(22.1,53.15) v1(22.61,53.79) v1(22.99,53.15) v1(23.5,53.79) v1(23.88,53.15) v1(24.39,53.79)
SH_C: length 43.1
  Top Layer w0.203: C39.1 23.27,29.74 v2(23.27,30.56) ; v1(37.25,53.16) 37.71,52.7 37.71,47.26 39.34,45.62 39.34,41.99 38.82,41.47 38.13,41.47 37.33,40.66 37.33,34.71 v2(37.29,34.67)
  Top Layer w0.254: U8.12 26.99,28.99 26.74,29.25 C39.1
  Bottom Layer w0.203: v2(37.29,34.67) 37.29,33.31 33.32,29.34 27.38,29.34 26.16,30.56 v2(23.27,30.56)
  vias: v1(22.96,59.46) v1(22.96,58.45) v1(22.95,57.38) v1(23.72,59.84) v1(23.72,58.95) v1(23.72,57.94) v1(23.72,56.79) v1(24.63,59.39) v1(24.63,58.37) v1(24.61,57.3) v1(25.86,59.36) v1(25.86,58.06) v1(25.86,56.62) v1(27.94,54.25) v1(28.19,53.49) v1(28.83,54.25) v1(29.08,53.49) v1(29.72,54.25) v1(29.97,53.49) v1(30.61,54.25) v1(30.86,53.49) v1(32.81,53.16) v1(33.31,53.8) v1(33.69,53.16) v1(34.2,53.8) v1(34.58,53.16) v1(35.09,53.8) v1(35.47,53.16) v1(35.98,53.8) v1(36.36,53.16) v1(36.87,53.8)
SN_A: length 11.8
  Top Layer w0.203: 9.91,44.53 9.91,42.34 9.22,41.66 5.16,41.66 3.4,39.9 3.4,39.4 2.38,38.37 U7.4
SN_B: length 11.1
  Top Layer w0.203: R29.2 22.61,42.06 22.07,41.53 20.3,41.53 19.34,40.57 17.95,40.57 16.89,39.51 16.89,38.69 16.34,38.14 U9.4
SN_C: length 11.3
  Top Layer w0.203: U10.4 27.82,38.16 28.65,38.99 28.65,39.61 29.61,40.56 31.14,40.56 32.23,41.66 33.83,41.66 34.52,42.34 34.52,44.53
SPI1_CS: length 29.7
  Top Layer w0.203: v2(6.66,15.09) 6.61,15.13 4.64,15.13 ; v2(27.31,15.62) 28.6,15.62 28.9,15.32 30.18,15.32 30.11,15.39
  Inner2 w0.203: v2(6.66,15.09) 10.21,15.09 13.33,11.96 25.55,11.96 27.15,13.56 27.15,15.47 v2(27.31,15.62)
SPI1_MISO: length 26.9
  Top Layer w0.203: v2(27.99,13.79) 28.52,14.32 30.18,14.32 ; v2(6.66,12.65) 6.58,12.57 5.38,12.57
  Inner2 w0.203: v2(6.66,12.65) 8.75,12.65 10.15,11.25 25.78,11.25 27.99,13.47 v2(27.99,13.79)
SPI1_MOSI: length 28.5
  Top Layer w0.203: 30.18,14.82 28.64,14.82 28.3,15.16 v2(27.76,15.16) ; v2(6.66,13.87) 5.11,13.87
  Inner2 w0.203: v2(27.76,15.16) 27.56,14.96 27.56,13.5 25.66,11.61 13.18,11.61 10.92,13.87 v2(6.66,13.87)
SPI1_SCK: length 27.1
  Top Layer w0.203: 4.64,11.38 4.67,11.35 v2(6.66,11.35) ; v2(28.68,13.82) 30.18,13.82
  Inner2 w0.203: v2(28.68,13.82) 28.68,13.53 26.04,10.9 10.04,10.9 9.58,11.35 v2(6.66,11.35)
SWCLK: length 15.9
  Top Layer w0.203: U5.49 16.98,19.32 v2(16.94,19.36) ; 4.68,23.28 4.72,23.32 v2(5.97,23.32)
  Bottom Layer w0.203: v2(5.97,23.32) 6.2,23.55 12.75,23.55 v2(16.94,19.36)
SWDIO: length 19.2
  Top Layer w0.203: v2(5.97,24.54) 4.69,24.54 4.68,24.53 ; 21.68,21.32 v2(21.68,22.86)
  Bottom Layer w0.203: v2(5.97,24.54) 13.13,24.54 14.81,22.86 v2(21.68,22.86)
TEMP: length 46
  Top Layer w0.178: 40.74,53.12 39.36,51.75 R23.1 38.94,51.52 38.94,47.04 39.97,46.01 39.97,41.73 39.08,40.84 38.39,40.84 37.95,40.4 37.95,35.46 v2(38.73,34.67)
  Top Layer w0.203: v2(31.8,16.84) 31.78,16.82 30.18,16.82 ; 40.79,53.04 40.79,53.13 C40.2 40.74,53.12 40.74,53.1
  Inner2 w0.203: v2(31.8,16.84) 32.03,17.07 32.03,30.71 34.77,33.45 37.65,33.45 38.73,34.54 v2(38.73,34.67)
TIM1_CH1: length 7
  Top Layer w0.203: U8.22 28.49,24.43 27.62,23.56 25.26,23.56 24.19,22.48 U5.41
TIM1_CH1N: length 7.4
  Top Layer w0.203: 27.68,21.32 27.68,22.42 28.02,22.76 29.64,22.76 31.04,24.16 v2(31.04,25.22) 30.48,25.78 U8.1
TIM1_CH2: length 8.2
  Top Layer w0.203: U8.23 28.99,24.24 v2(28.3,23.55) ; 23.68,21.32 23.68,22.75 v2(23.88,22.94)
  Bottom Layer w0.203: v2(28.3,23.55) 24.49,23.55 v2(23.88,22.94)
TIM1_CH2N: length 9.1
  Top Layer w0.203: v2(27.23,22.63) 27.23,21.36 U5.35 ; v2(31.57,25.53) 30.82,26.28 U8.2
  Bottom Layer w0.203: v2(31.57,25.53) 31.57,24.69 29.52,22.63 v2(27.23,22.63)
TIM1_CH3: length 9.5
  Top Layer w0.203: U5.43 23.19,22.87 v2(23.11,22.94) ; v2(29.52,24.23) 29.49,24.26 U8.24
  Inner2 w0.203: v2(29.52,24.23) 29.31,24.03 24.21,24.03 v2(23.11,22.94)
TIM1_CH3N: length 9.8
  Top Layer w0.203: v2(30.51,24.31) 29.31,23.11 27.03,23.11 26.68,22.77 26.68,21.32
  Top Layer w0.229: v2(31.42,26.44) 31.08,26.78 U8.3
  Bottom Layer w0.203: v2(30.51,24.31) 30.51,25.53 v2(31.42,26.44)
USART1_RX: length 23.7
  Top Layer w0.203: v2(20.14,14.25) 20.07,14.32 U5.59 ; J1.2 40.19,9.22 v2(38.35,9.22)
  Bottom Layer w0.203: v2(20.14,14.25) 20.25,14.36 33.22,14.36 v2(38.35,9.22)
USART1_TX: length 23.3
  Top Layer w0.203: U5.58 20.14,14.82 ; v2(38.43,10.52) 40.14,10.52 J1.3
  Bottom Layer w0.203: v2(20.19,14.86) 20.36,14.69 33.99,14.69 38.16,10.52 v2(38.43,10.52)
USB_D+: length 5.1
  Top Layer w0.178: 12.07,9.14 v2(12.07,8.84) 12.07,7.67 ; 12.06,7.59 12.07,7.59 ; R11.2 11.06,9.24 11.06,8.85 ; 11.06,7.44 11.06,8.85 ; 11.06,8.85 v2(11.07,8.84)
  Bottom Layer w0.178: v2(12.07,8.84) v2(11.07,8.84)
USB_D-: length 4.8
  Top Layer w0.178: 11.56,7.44 11.56,8.33 ; 11.56,8.33 11.53,8.36 v2(11.53,8.38) ; 11.56,8.33 11.56,9.25 12.15,9.84 R10.2 ; v2(10.54,8.38) 10.56,8.36 10.56,7.44
  Bottom Layer w0.178: v2(10.54,8.38) v2(11.53,8.38)
USB_DN: length 17.7
  Top Layer w0.178: v2(22.73,19.81) 22.6,19.95 22.6,20.15 22.68,20.23 22.68,21.32 ; R10.1 11.68,11.96 v2(11.68,12.18)
  Bottom Layer w0.178: v2(22.73,19.81) 22.6,19.68 22.6,19.06 21.96,18.42 17.31,18.42 11.54,12.65 11.54,12.32 v2(11.68,12.18)
USB_DP: length 17.7
  Top Layer w0.178: v2(22.12,19.81) 22.27,19.96 22.27,20.15 22.19,20.23 U5.45 ; R11.1 11.07,11.96 v2(11.07,12.18)
  Bottom Layer w0.178: v2(11.07,12.18) 11.21,12.32 11.21,12.79 17.17,18.75 21.82,18.75 22.27,19.2 22.27,19.67 v2(22.12,19.81)
VB_A: length 8.2
  Top Layer w0.254: D4.1 C35.2 23.09,23.94 26.89,23.94 27.49,24.54 U8.20
VB_B: length 7
  Top Layer w0.203: 20.44,26.96 D5.1
  Top Layer w0.254: 20.44,26.96 C36.2 22.36,26.27 22.82,25.81 24.92,25.81 25.39,26.28 U8.17
VB_C: length 6.5
  Top Layer w0.203: 20.44,29.25 D6.1
  Top Layer w0.254: U8.14 24.79,27.78 24.47,28.1 23.51,28.1 C39.2 20.44,29.25
VGS: length 44.4
  Top Layer w0.203: 41.49,19.82 41.24,19.57 D1.1 ; C37.2 32.19,27.28
  Top Layer w0.254: U8.4 32.19,27.28 ; D4.2 18.09,24 v4(18.16,23.93)
  Top Layer w0.305: v4(32.64,25.76) 32.64,26.83 C37.2 ; D4.2 D5.2 D6.2 ; v4(39.91,15.8) 39.91,19.4 D1.1
  Bottom Layer w0.254: v4(32.64,25.76) 32.64,26.29 31.88,27.05 31.19,27.05 28.37,24.23 26.92,24.23 26.62,23.93 v4(18.16,23.93)
  Bottom Layer w0.305: v4(39.91,15.8) 32.64,23.07 v4(32.64,25.76)
VUSB: length 28.5
  Top Layer w0.381: D3.2 17.93,2.29 15.57,4.65 13.97,4.65 12.75,5.87 ; 12.75,5.87 13.71,6.83 USB1.11 ; 12.75,5.87 9.89,5.87 8.91,6.85 USB1.2
$1N5380: length 4.5
  Top Layer w0.203: 43.08,21.85 43.08,20.01 43.27,19.82 41.76,18.31 R1.1
$1N5382: length 5.4
  Top Layer w0.305: D1.2 38.44,20.62 L1.1
  Top Layer w0.381: L1.1 41.03,21.71 41.17,21.85
$1N5911: length 2.8
  Top Layer w0.305: U4.1 39.44,31.17 38.54,31.17 C5.1
$1N5913: length 6.7
  Top Layer w0.203: R4.2 39.98,29.39 C11.2 42.23,30.72 ; 42.23,30.72 41.72,31.23 U4.3 ; 42.23,30.72 43.31,31.81 R5.2
$1N5917: length 5.3
  Top Layer w0.508: U4.6 39.82,33.89 39.62,34.09 38.16,34.09 C5.2 35.01,33.52 L2.1
$1N6293: length 2
  Top Layer w0.203: 37.36,15.02 R2.2 37.37,16.97
$4N2117: length 11.8
  Top Layer w0.203: Q1.4 0.94,53.01 0.94,42.97 R20.2
$4N2305: length 6.4
  Top Layer w0.229: 14.58,42.99 14.58,45.23 11.88,47.93 Q4.4
$4N2829: length 12.8
  Top Layer w0.229: Q2.4 14.35,53.62 13.33,52.6 13.33,47.66 16.87,44.13 16.87,42.99
$4N2834: length 6.2
  Top Layer w0.229: R25.2 27.28,44.96 24.38,47.86 Q5.4
$4N3102: length 12.6
  Top Layer w0.229: Q3.4 26.8,53.5 25.78,52.48 25.78,47.43 29.44,43.77 R22.2
$4N3107: length 4.5
  Top Layer w0.229: R27.2 38.43,44.34 38.43,46.05 36.86,47.62 Q6.4
$5N15035: length 3.9
  Top Layer w0.254: C26.2 32.52,18.32 30.18,18.32
$5N15318: length 2
  Top Layer w0.203: 37.31,12.74 LED3.2
  Top Layer w0.254: R17.1 37.31,12.74
$5N16585: length 5.6
  Top Layer w0.203: U5.60 16.76,13.82 15.88,14.71 15.88,15.63 R9.1
$5N18370: length 7.9
  Top Layer w0.254: U5.8 24.19,8.46 v2(23.95,8.23)
  Bottom Layer w0.203: 22.04,11.1 C21.2
  Bottom Layer w0.254: v2(23.95,8.23) 22.04,10.14 22.04,11.1 ; R12.2 21.98,11.35 C21.2
$5N18378: length 7.1
  Top Layer w0.254: v2(24.71,8.23) 24.68,8.26 24.68,9.82
  Bottom Layer w0.254: R13.2 25.72,12.53 C22.2 24.71,10.56 v2(24.71,8.23)
$5N18386: length 8
  Top Layer w0.254: v2(25.63,8.23) 25.19,8.67 U5.10
  Bottom Layer w0.254: R14.2 27.9,11.35 C23.2 ; C23.2 27.9,10.5 v2(25.63,8.23) ; C23.2 27.92,11.03

## Copper pours and planes (outline as drawn; the poured copper is in the pictures)
GND on Top Layer: -4.17,35.13 47.12,35.13 47.12,-1.9 -4.17,-1.9
GND on Bottom Layer: -5.77,35.13 46.13,35.13 46.13,-8.84 -5.77,-8.84
GND on Inner1: 0.26,35.43 44.88,35.43 44.88,0.26 0.26,0.26
GND on Inner2: -3.17,34.98 54.13,34.98 54.13,-5.41 -3.17,-5.41
PGND on Top Layer: 20.57,40.54 24.64,40.54 24.64,35.85 20.57,35.85
PGND on Top Layer: 41.87,43.71 44.97,43.71 44.97,39.52 41.87,39.52
PGND on Top Layer: 7.87,40.67 11.94,40.67 11.94,35.98 7.87,35.98
PGND on Top Layer: 32.49,40.67 36.55,40.67 36.55,35.98 32.49,35.98
PGND on Bottom Layer: 1,43.78 44.8,43.78 44.8,35.75 1,35.75
PGND on Bottom Layer: 1,42.76 1.02,42.96 1.08,43.15 1.17,43.33 1.3,43.48 1.45,43.61 1.63,43.7 1.82,43.76 2.02,43.78 43.9,43.78 44.1,43.76 44.29,43.7 44.47,43.61 44.62,43.48 44.75,43.33 44.84,43.15 44.9,42.96 44.92,42.76 44.92,36.77 44.9,36.57 44.84,36.38 44.75,36.2 44.62,36.05 44.47,35.92 44.29,35.83 44.1,35.77 43.9,35.75 2.02,35.75 1.82,35.77 1.63,35.83 1.45,35.92 1.3,36.05 1.17,36.2 1.08,36.38 1.02,36.57 1,36.77
VCC_3.3V on Inner1: 14.48,22.86 36.3,22.86 36.3,8.59 14.48,8.59
VCC_5V on Top Layer: 29.52,32.32 40.81,32.32 40.81,23.32 29.52,23.32
DCBUS on Top Layer: 41.91,48.91 45.01,48.91 45.01,44.72 41.91,44.72
DCBUS on Bottom Layer: 1.12,51.33 1.14,51.53 1.19,51.72 1.29,51.9 1.42,52.05 1.57,52.18 1.74,52.27 1.94,52.33 2.13,52.35 43.89,52.35 44.09,52.33 44.28,52.27 44.46,52.18 44.61,52.05 44.74,51.9 44.83,51.72 44.89,51.53 44.91,51.33 44.91,45.67 44.89,45.47 44.83,45.28 44.74,45.11 44.61,44.95 44.46,44.82 44.28,44.73 44.09,44.67 43.89,44.65 2.13,44.65 1.94,44.67 1.74,44.73 1.57,44.82 1.42,44.95 1.29,45.11 1.19,45.28 1.14,45.47 1.12,45.67
DCBUS on Bottom Layer: 1.12,52.35 44.8,52.35 44.8,44.65 1.12,44.65
DCBUS on Inner2: -2.79,65.08 48.64,65.08 48.64,35.89 -2.79,35.89
SH_A on Top Layer: 2.54,60.1 16.82,60.1 16.82,52.53 2.54,52.53
SH_A on Bottom Layer: 2.54,60.1 16.82,60.1 16.82,52.55 2.54,52.55
SH_B on Top Layer: 15.11,60.1 25.2,60.1 25.2,52.86 15.11,52.86
SH_B on Bottom Layer: 15.11,60.1 25.2,60.1 25.2,52.86 15.11,52.86
SH_C on Top Layer: 22.35,60.1 37.72,60.1 37.72,52.73 22.35,52.73
SH_C on Bottom Layer: 22.37,60.1 37.73,60.1 37.73,52.73 22.37,52.73
SN_A on Top Layer: 7.24,48.82 12.13,48.82 12.13,43.32 7.24,43.32
SN_B on Top Layer: 19.88,48.69 24.77,48.69 24.77,43.19 19.88,43.19
SN_C on Top Layer: 32.26,48.82 37.21,48.82 37.21,43.32 32.26,43.32

Small or netless copper shapes (teardrops, artwork), in the pictures only: 16 on Inner1

## Text on the board
Bottom Silkscreen Layer: 5V | 3V3 | GND | CANL | CANH | SWCLK | SWDIO | SPI1_CS | SPI1_SCLK | SPI1_MOSI | SPI1_MISO | AVCC | U1TXD | U1RXD
Top Silkscreen Layer: JLCJLCJLCJLC | RST | KEY
